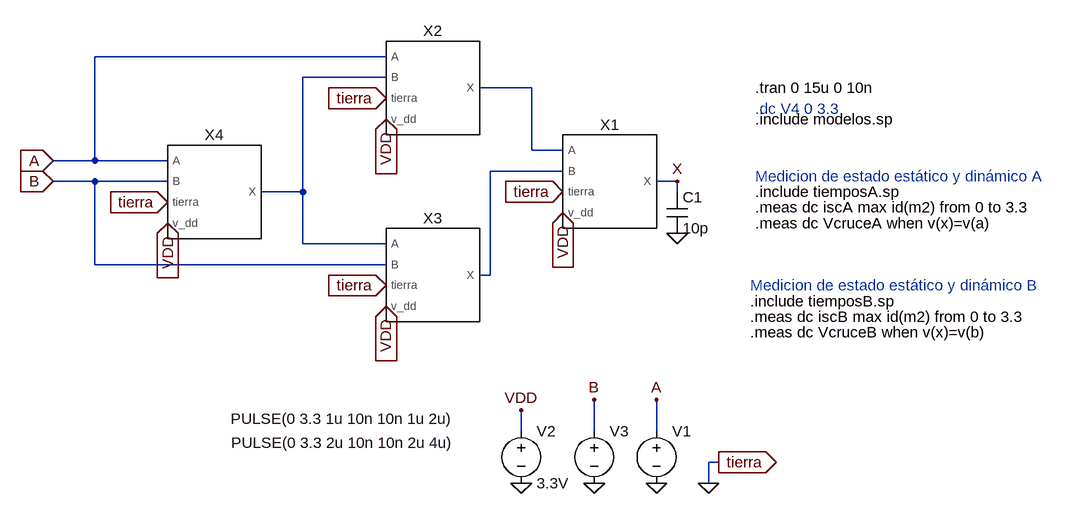
[diagram p0: schematic Xnor_2mA.asc]
Xnor_2mA.asc, the LTspice schematic file:
Version 4
SHEET 1 1484 824
WIRE -128 -208 -576 -208
WIRE -128 -176 -256 -176
WIRE 96 -160 16 -160
WIRE 96 -64 96 -160
WIRE 144 -64 96 -64
WIRE -576 -48 -576 -208
WIRE -576 -48 -640 -48
WIRE -464 -48 -576 -48
WIRE 144 -32 32 -32
WIRE -576 -16 -640 -16
WIRE -464 -16 -576 -16
WIRE 320 -16 288 -16
WIRE -256 0 -256 -176
WIRE -256 0 -320 0
WIRE 320 0 320 -16
WIRE -256 80 -256 0
WIRE -128 80 -256 80
WIRE -576 112 -576 -16
WIRE -128 112 -576 112
WIRE 32 128 32 -32
WIRE 32 128 16 128
WIRE 80 368 80 336
WIRE 192 368 192 320
WIRE 288 368 288 320
WIRE 384 416 368 416
WIRE 368 448 368 416
FLAG 80 336 VDD
FLAG 288 320 A
FLAG 192 320 B
FLAG 80 448 0
FLAG 192 448 0
FLAG 288 448 0
FLAG 144 0 tierra
IOPIN 144 0 In
FLAG 144 32 VDD
IOPIN 144 32 In
FLAG 368 448 0
FLAG 384 416 tierra
IOPIN 384 416 Out
FLAG 320 64 0
FLAG -128 -144 tierra
IOPIN -128 -144 In
FLAG -128 -112 VDD
IOPIN -128 -112 In
FLAG -128 144 tierra
IOPIN -128 144 In
FLAG -128 176 VDD
IOPIN -128 176 In
FLAG -640 -48 A
IOPIN -640 -48 In
FLAG -640 -16 B
IOPIN -640 -16 In
FLAG -464 16 tierra
IOPIN -464 16 In
FLAG -464 48 VDD
IOPIN -464 48 In
FLAG 320 -16 X
SYMBOL voltage 288 352 R0
WINDOW 3 -655 -3 Left 2
WINDOW 123 0 0 Left 0
WINDOW 39 0 0 Left 0
SYMATTR Value PULSE(0 3.3 1u 10n 10n 1u 2u)
SYMATTR InstName V1
SYMBOL voltage 80 352 R0
WINDOW 123 0 0 Left 0
WINDOW 39 0 0 Left 0
SYMATTR InstName V2
SYMATTR Value 3.3V
SYMBOL cap 304 0 R0
SYMATTR InstName C1
SYMATTR Value 10p
SYMBOL voltage 192 352 R0
WINDOW 3 -558 34 Left 2
WINDOW 123 0 0 Left 0
WINDOW 39 0 0 Left 0
SYMATTR Value PULSE(0 3.3 2u 10n 10n 2u 4u)
SYMATTR InstName V3
SYMBOL Instancia_NOR_2mA 208 -16 R0
SYMATTR InstName X1
SYMBOL Instancia_NOR_2mA -64 -160 R0
SYMATTR InstName X2
SYMBOL Instancia_NOR_2mA -64 128 R0
SYMATTR InstName X3
SYMBOL Instancia_NOR_2mA -400 0 R0
SYMATTR InstName X4
TEXT 440 -112 Left 2 !.include modelos.sp
TEXT 440 -160 Left 2 !.tran 0 15u 0 10n
TEXT 440 48 Left 2 !.meas dc VcruceA when v(x)=v(a)
TEXT 440 0 Left 2 !.include tiemposA.sp
TEXT 440 24 Left 2 !.meas dc iscA max id(m2) from 0 to 3.3
TEXT 440 -24 Left 2 ;Medicion de estado estático y dinámico A
TEXT 432 216 Left 2 !.meas dc VcruceB when v(x)=v(b)
TEXT 432 192 Left 2 !.meas dc iscB max id(m2) from 0 to 3.3
TEXT 432 144 Left 2 ;Medicion de estado estático y dinámico B
TEXT 432 168 Left 2 !.include tiemposB.sp
TEXT 440 -128 Left 2 ;.dc V4 0 3.3

The netlist it stands for:
* Xnor_2mA.asc
V1 A 0 PULSE(0 3.3 1u 10n 10n 1u 2u)
V2 VDD 0 3.3V
C1 X 0 10p
V3 B 0 PULSE(0 3.3 2u 10n 10n 2u 4u)
XX1 N002 N003 0 VDD X Instancia_NOR_2mA  ; pins A B tierra v_dd X
XX2 A N001 0 VDD N002 Instancia_NOR_2mA  ; pins A B tierra v_dd X
XX3 N001 B 0 VDD N003 Instancia_NOR_2mA  ; pins A B tierra v_dd X
XX4 A B 0 VDD N001 Instancia_NOR_2mA  ; pins A B tierra v_dd X
.include modelos.sp
.tran 0 15u 0 10n
.meas dc VcruceA when v(x)=v(a)
.include tiemposA.sp
.meas dc iscA max id(m2) from 0 to 3.3
* Medicion de estado estático y dinámico A
.meas dc VcruceB when v(x)=v(b)
.meas dc iscB max id(m2) from 0 to 3.3
* Medicion de estado estático y dinámico B
.include tiemposB.sp
* .dc V4 0 3.3
.backanno
.end

* Results of the author's LTspice run, read from the files saved beside the schematic
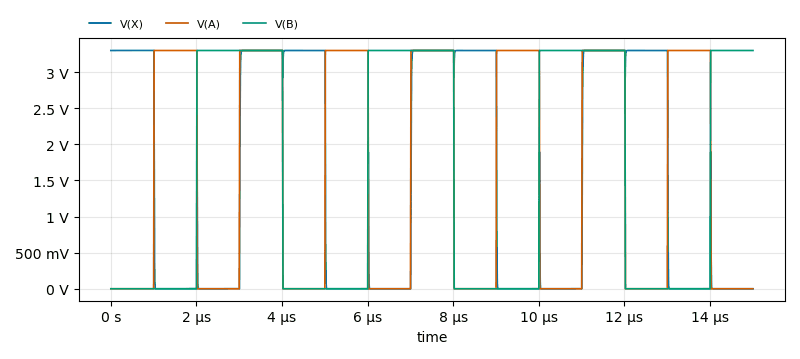
[diagram p1: Transient Analysis of Xnor_2mA.asc, plotted from the saved traces]
* Transient Analysis, 1 run:
*   V(X): min -588.2 µV, max 3.302 V, average 1.548 V, rms 2.253 V, last 334.9 nV
*   V(A): min 0 V, max 3.3 V, average 1.555 V, rms 2.262 V, last 0 V
*   V(B): min 0 V, max 3.3 V, average 1.545 V, rms 2.256 V, last 3.3 V